# Altium schematic sheet Nano_Power_Detection.SchDoc
size A4; SheetNumber: 3; SheetTotal: 3
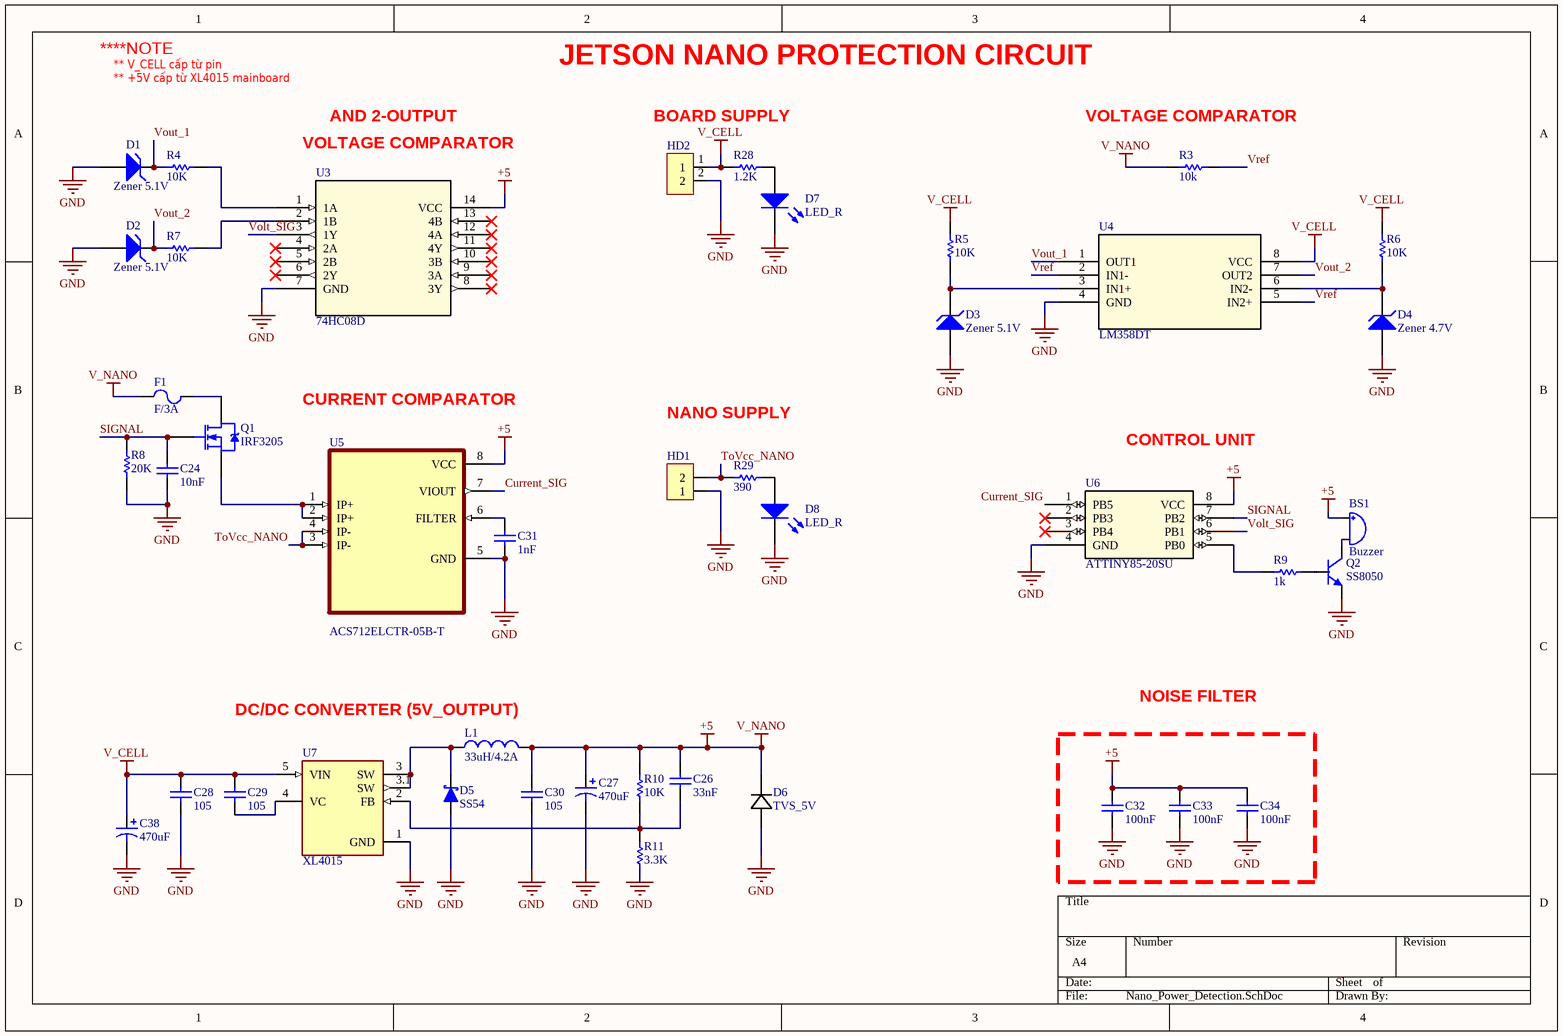
[diagram p0: Nano_Power_Detection.SchDoc]

## Parts
BS1  Buzzer  [Buzzer]
C24  10nF  [6-0805_M]
C26  33nF  [6-0805_M]
C27  470uF  [CAP-ALU-SMD-F]
C28  105  [C1206]
C29  105  [C1206]
C30  105  [C1206]
C31  1nF  [6-0805_M]
C32  100nF  [6-0805_M]
C33  100nF  [6-0805_M]
C34  100nF  [6-0805_M]
C38  470uF  [CAP-ALU-SMD-F]
D1  Zener 5.1V  [3.5X2.8X1.9]
D2  Zener 5.1V  [3.5X2.8X1.9]
D3  Zener 5.1V  [3.5X2.8X1.9]
D4  Zener 4.7V  [3.5X2.8X1.9]
D5  SS54  [DIOT_M5_025X220N]
D6  TVS_5V  [DIOT_M5_025X220N]
D7  LED_R  [6-0805_M]
D8  LED_R  [6-0805_M]
F1  F/3A  [FUSE (6.1 x 2.69 x 2.69mm) - duplicate]
HD1  Header2  [HDR2]  (value not drawn)
HD2  2_pin connector  [2_PIN POWER 3.96]  (value not drawn)
L1  33uH/4.2A  [IND_CDRH127/LDNP-470MC_SUM]
Q1  IRF3205  [TO-263]
Q2  SS8050  [SOT23_M]
R3  10k  [6-0805_N]
R4  10K  [6-0805_N]
R5  10K  [6-0805_N]
R6  10K  [6-0805_N]
R7  10K  [6-0805_N]
R8  20K  [6-0805_N]
R9  1k  [6-0805_N]
R10  10K  [6-0805_N]
R11  3.3K  [6-0805_N]
R28  1.2K  [C1206]
R29  390  [6-0805_N]
U3  74HC08D  [SO14_SOT108-1_NEX]
U4  LM358DT  [SOIC127P600X175-8N]
U5  ACS712ELCTR-05B-T  [SOIC127P600X175-8N]
U6  ATTINY85-20SU  [8S2_ATM]
U7  XL4015  [CONV_XL4015]

## Nets
+5: BS1.1 C26.2 C27.1 C30.2 C32.1 C33.1 C34.1 D6.1 F1.1 L1.2 R3.2 R10.1 U3.14(VCC) U5.8(VCC) U6.8(VCC)  [also labelled V_NANO]
GND: C24.2 C27.2 C28.1 C30.1 C31.2 C32.2 C33.2 C34.2 C38.2 D1.1(A) D2.1(A) D3.1(A) D4.1(A) D5.2(A) D6.2 D7.2(K) D8.2(K) HD1.1 HD2.2 Q2.2(E) R8.1 R11.2 U3.7(GND) U4.4(GND) U5.5(GND) U6.4(GND) U7.1(GND)
V_CELL: C28.2 C29.2 C38.1 HD2.1 R5.2 R6.2 R28.2 U4.8(VCC) U7.5(VIN)
Current_SIG: U5.7(VIOUT) U6.1(PB5)
SIGNAL: C24.1 Q1.1(G) R8.2 U6.7(PB2)
ToVcc_NANO: HD1.2 R29.2 U5.3(IP-) U5.4(IP-)
Volt_SIG: U3.3(1Y) U6.6(PB1)
Vout_1: D1.2(K) R4.2 U4.1(OUT1)
Vout_2: D2.2(K) R7.2 U4.7(OUT2)
Vref: R3.1 U4.2(IN1-) U4.5(IN2+)
NetBS1_2: BS1.2 Q2.1(C)
NetC26_1: C26.1 R10.2 R11.1 U7.2(FB)
NetC29_1: C29.1 U7.4(VC)
NetC31_1: C31.1 U5.6(FILTER)
NetD3_2: D3.2(K) R5.1 U4.3(IN1+)
NetD4_2: D4.2(K) R6.1 U4.6(IN2-)
NetD5_1: D5.1(K) L1.1 U7.3(SW) U7.3.1(SW)
NetD7_1: D7.1(A) R28.1
NetD8_1: D8.1(A) R29.1
NetF1_2: F1.2 Q1.2(D)
NetQ1_3: Q1.3(S) U5.1(IP+) U5.2(IP+)
NetQ2_3: Q2.3(B) R9.1
NetR4_1: R4.1 U3.1(1A)
NetR7_1: R7.1 U3.2(1B)
NetR9_2: R9.2 U6.5(PB0)

Not connected (* = marked no-connect by the designer): U3 4(2A)* 5(2B)* 6(2Y)* 8(3Y)* 9(3A)* 10(3B)* 11(4Y)* 12(4A)* 13(4B)*; U6 2(PB3)* 3(PB4)*

## Notes on the sheet
- ****NOTE
- ** V_CELL cấp từ pin
- ** +5V cấp từ XL4015 mainboard
- JETSON NANO PROTECTION CIRCUIT
- VOLTAGE COMPARATOR
- AND 2-OUTPUT
- BOARD SUPPLY
- (near R3) VOLTAGE COMPARATOR
- CURRENT COMPARATOR
- NANO SUPPLY
- CONTROL UNIT
- (near L1) DC/DC CONVERTER (5V_OUTPUT)
- NOISE FILTER

## Library data of the parts
C24 C26 C28-C34 = Cap: Capacitor; Published: 8-Jun-2000; LatestRevisionDate: 17-Jul-2002; LatestRevisionNote: Re-released for DXP Platform.; PackageReference: RAD-0.3; Publisher: Altium Limited; PackageDescription: Radial Cap, Thru-Hole; 2 Leads; 0.3 in Pin Spacing
C27 C38 = Cap Pol3: Polarized Capacitor (Surface Mount); Value: 680uF; Published: 8-Jun-2000; LatestRevisionDate: 29-May-2009; LatestRevisionNote: IPC-7351 Footprint Added.; PackageReference: C0805; Publisher: Altium Limited; PackageDescription: Chip Capacitor
D1-D4 = D Zener: Zener Diode; Published: 8-Jun-2000; LatestRevisionDate: 17-Jul-2002; LatestRevisionNote: Re-released for DXP Platform.; PackageReference: DIODE-0.7; Publisher: Altium Limited; PackageDescription: Diode, Thru-Hole; 2 Leads; 0.7 in Pin Spacing
D5 = SS54-HF: Diode Schottky 40 V 5A Surface Mount DO-214AC (SMA); MF: Comchip Technology; SnapEDA_Link: https://www.snapeda.com/parts/SS54-HF/Comchip/view-part/?ref=snap; Package: DO-214AC-214 Comchip Technology; Value: *; MP: SS54-HF; Check_prices: https://www.snapeda.com/parts/SS54-HF/Comchip/view-part/?ref=eda
D7 D8 = LED1: Typical RED GaAs LED; Published: 8-Jun-2000; LatestRevisionDate: 08-Jul-2005; LatestRevisionNote: Mech Layer 1 removed.; PackageReference: LED-1; Publisher: Altium Limited; PackageDescription: LED; 2 Leads
F1 = Fuse
HD1 = Header2: Header IDC, 2 x 1 Pin Vertical 2.54mm Pitch (Non-Boxed, Male); Manufacturer: W¨¹rth Elektronik eiSos GmbH; partNo: 613002143121; ComponentLink1 Description: Manufacturer; ComponentLink2 Description: Datasheet; NoPins: 02; Created Date: 29 March 2013; ComponentLink1URL: http://www.we-online.com; ComponentLink2URL: http://katalog.we-online.de/em/datasheet/6130xx143121.pdf; Created by: Karrer Zheng
L1 = Inductor: Code_IEC: 1005; Published: 8-Jun-2000; LatestRevisionDate: 29-May-2009; LatestRevisionNote: IPC-7351 Footprint Added.; PackageReference: 0402-A; Publisher: Altium Limited; PackageDescription: Chip Inductor; Code_JEITA: 0402
Q1 = IRFZ44: Value: IRF840
Q2 = SS8050: NPN General Purpose Amplifier; Published: 8-Jun-2000; LatestRevisionDate: 15-Jan-2003; LatestRevisionNote: PCB Footprint 'BCY-W3/D4.7' replaced; DatasheetVersion: 1997; PackageVersion: Sep-1998; PackageReference: TO-92A; Publisher: Altium Limited; PackageDescription: TO, Flat Index; 3 In-Line, Axial Leads; Body Dia. 4.5mm; Leads 0.51 x 0.48 mm (max); ComponentLink1Description: Manufacturer Link; ComponentLink1URL: http://www.fairchildsemi.com/; ComponentLink2Description: Datasheet; ComponentLink2URL: http://www.fairchildsemi.com/ds/2N%2F2N3904.pdf
R3 R5-R7 = Res1: Resistor; Published: 8-Jun-2000; LatestRevisionDate: 17-Jul-2002; LatestRevisionNote: Re-released for DXP Platform.; PackageReference: AXIAL-0.3; Publisher: Altium Limited; PackageDescription: Axial Device, Thru-Hole; 2 Leads; 0.3 in Pin Spacing; Value: 10K
R4 R10 R11 = Res1: Resistor; Value: 1.5k; Published: 8-Jun-2000; LatestRevisionDate: 17-Jul-2002; LatestRevisionNote: Re-released for DXP Platform.; PackageReference: AXIAL-0.3; Publisher: Altium Limited; PackageDescription: Axial Device, Thru-Hole; 2 Leads; 0.3 in Pin Spacing
R8 = Res1: Resistor; Value: 15K; Published: 8-Jun-2000; LatestRevisionDate: 17-Jul-2002; LatestRevisionNote: Re-released for DXP Platform.; PackageReference: AXIAL-0.3; Publisher: Altium Limited; PackageDescription: Axial Device, Thru-Hole; 2 Leads; 0.3 in Pin Spacing
R9 R28 R29 = Res1: Resistor; Value: 10K; Published: 8-Jun-2000; LatestRevisionDate: 17-Jul-2002; LatestRevisionNote: Re-released for DXP Platform.; PackageReference: AXIAL-0.3; Publisher: Altium Limited; PackageDescription: Axial Device, Thru-Hole; 2 Leads; 0.3 in Pin Spacing
U5 = ACS712ELCTR-05B-T: Current Sensor 5A 1 Channel Hall Effect, Open Loop Bidirectional 8-SOIC (0.154, 3.90mm Width); MF: Allegro; SnapEDA_Link: https://www.snapeda.com/parts/ACS712ELCTR-05B-T/Allegro/view-part/?ref=snap; Package: SOIC-8 Allegro MicroSystems LLC; Value: *; MP: ACS712ELCTR-05B-T; Check_prices: https://www.snapeda.com/parts/ACS712ELCTR-05B-T/Allegro/view-part/?ref=eda
U7 = XL4015: 5A 180KHz 36V Buck DC to DC Converter; MF: XLSEMI; SnapEDA_Link: https://www.snapeda.com/parts/XL4015/XLSEMI/view-part/?ref=snap; Package: None; Value: *; MP: XL4015; Check_prices: https://www.snapeda.com/parts/XL4015/XLSEMI/view-part/?ref=eda